# Altium schematic sheet MCU152A_F28E12X_Device.SchDoc
size 431 x 279 mm; Date: Not shown in title block; ApprovedBy: Not shown in title block; CheckedBy: Not shown in title block; Author: Not shown in title block; CompanyName: Not shown in title block; Engineer: Not shown in title block; Organization: Not shown in title block; Address1: Not shown in title block; Address2: Not shown in title block; Address3: Not shown in title block; Address4: Not shown in title block; DocumentNumber: 4; Revision: Use project parameter SCH_Rev; SheetNumber: 4; SheetTotal: 8; PageSetup: Record=PageOptions|CenterHorizontal=True|CenterVertical=True|PrintScale=1.00|XCorrection=1.00|YCorrection=1.00|PrintKind=0|BorderSize=5000000|LeftOffset=0|BottomOffset=0|Orientation=2|PaperLength=1000|PaperWidth=1000|Scale=100|PaperSource=15|PrintQuality=600|MediaType=1|DitherType=10|PaperKind=Letter|PrintScaleMode=1; Orderable: LAUNCHXL-F2800157; CurrentTime: Not shown in title block; CurrentDate: Not shown in title block; Time: Not shown in title block; DocumentFullPathAndName: Not shown in title block; DocumentName: Not shown in title block; ModifiedDate: Not shown in title block; ImagePath: Not shown in title block
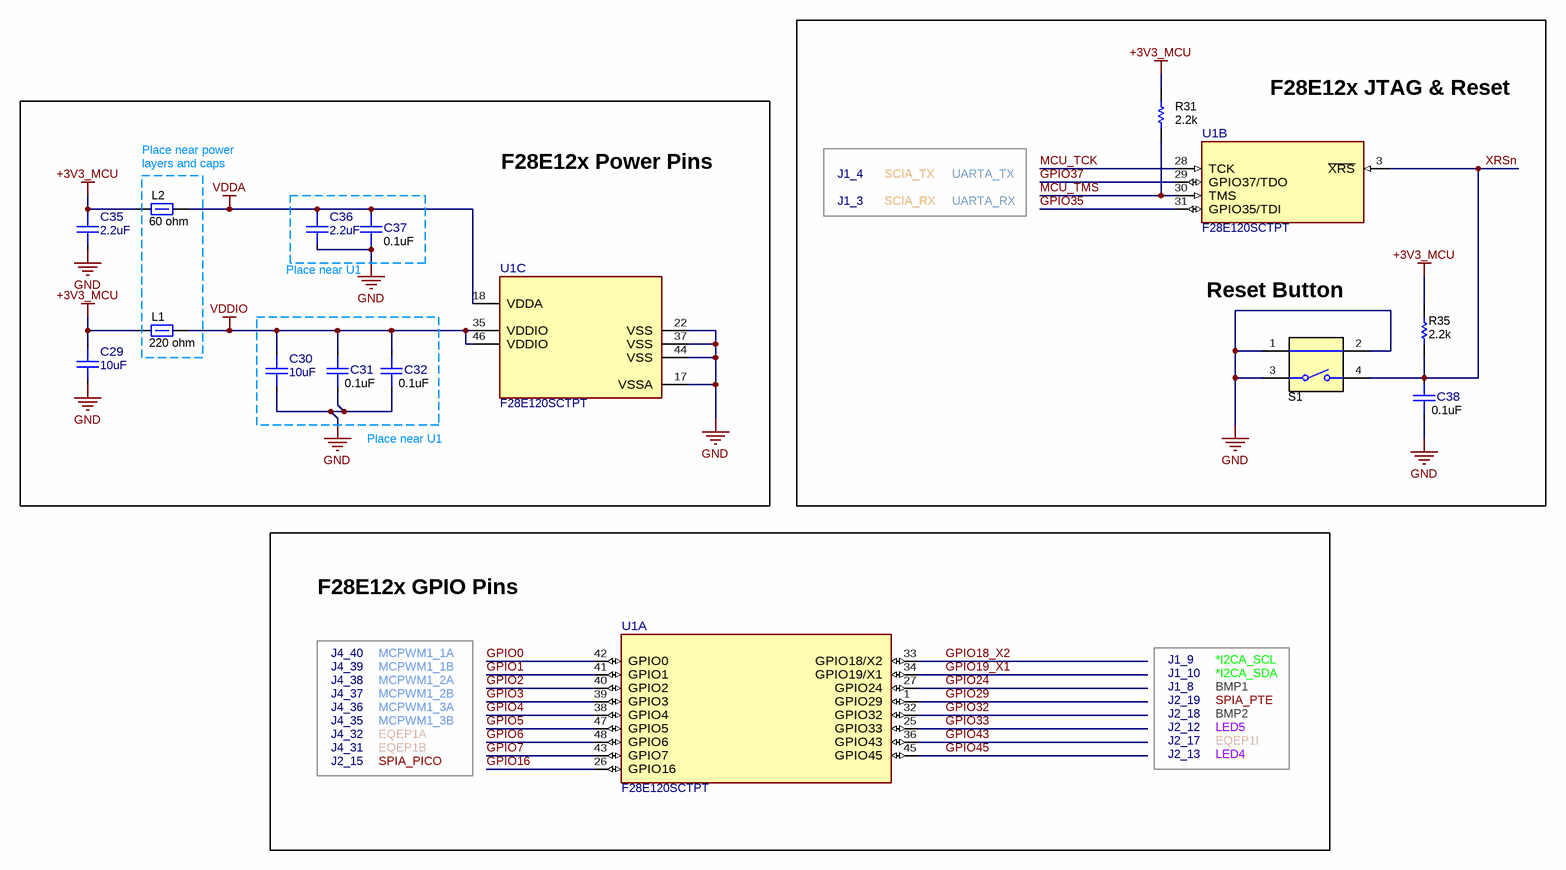
[diagram p0: MCU152A_F28E12X_Device.SchDoc]

## Parts
C29  ValueDisplayed: 10uF  [FP-885012106031_0603-MFG]  (hidden comment: 885012106031)
C30  ValueDisplayed: 10uF  [FP-885012106031_0603-MFG]  (hidden comment: 885012106031)
C31  ValueDisplayed: 0.1uF  [FP-885012205018_0402-MFG]  (hidden comment: 885012205018)
C32  ValueDisplayed: 0.1uF  [FP-885012205018_0402-MFG]  (hidden comment: 885012205018)
C35  ValueDisplayed: 2.2uF  [FP-885012106011_0603-MFG]  (hidden comment: 885012106011)
C36  ValueDisplayed: 2.2uF  [FP-885012106011_0603-MFG]  (hidden comment: 885012106011)
C37  ValueDisplayed: 0.1uF  [FP-885012205018_0402-MFG]  (hidden comment: 885012205018)
C38  ValueDisplayed: 0.1uF  [FP-885012205018_0402-MFG]  (hidden comment: 885012205018)
L1  ValueDisplayed: 220 ohm  [0805_HV]  (hidden comment: 742792022)
L2  value 60 ohm  [0805_HV]  (hidden comment: 742792063)
R31  ValueDisplayed: 2.2k  [0402]  (hidden comment: CRCW04022K20JNED)
R35  ValueDisplayed: 2.2k  [0402]  (hidden comment: CRCW04022K20JNED)
S1  1188E-1K2-V-TR  [SW_1188E]  (value not drawn)
U1  F28E120SCTPT  [PT0048A-MFG]  (parts A,B,C of 4)

## Blocks framed on the sheet
F28E12x Power Pins: C29-C32 C35-C37 L1 L2 U1
F28E12x GPIO Pins: U1

## Nets
+3V3_MCU: C29.1 C35.1 L1.1 L2.1 R31.2 R35.2
GND: C29.2 C30.2 C31.1 C32.1 C35.2 C36.2 C37.1 C38.1 S1.1 S1.2 S1.3 U1.17(VSSA) U1.22(VSS) U1.37(VSS) U1.44(VSS)
VDDA: C36.1 C37.2 L2.2 U1.18(VDDA)
VDDIO: C30.1 C31.2 C32.2 L1.2 U1.35(VDDIO) U1.46(VDDIO)
GPIO0: U1.42(GPIO0)
GPIO1: U1.41(GPIO1)
GPIO2: U1.40(GPIO2)
GPIO3: U1.39(GPIO3)
GPIO4: U1.38(GPIO4)
GPIO5: U1.47(GPIO5)
GPIO6: U1.48(GPIO6)
GPIO7: U1.43(GPIO7)
GPIO16: U1.26(GPIO16)
GPIO18_X2: U1.33(GPIO18/X2)
GPIO19_X1: U1.34(GPIO19/X1)
GPIO24: U1.27(GPIO24)
GPIO29: U1.1(GPIO29)
GPIO32: U1.32(GPIO32)
GPIO33: U1.25(GPIO33)
GPIO35: U1.31(GPIO35/TDI)
GPIO37: U1.29(GPIO37/TDO)
GPIO43: U1.36(GPIO43)
GPIO45: U1.45(GPIO45)
MCU_TCK: U1.28(TCK)
MCU_TMS: R31.1 U1.30(TMS)
XRSn: C38.2 R35.1 S1.4 U1.3(~{XRS})

## Notes on the sheet
- F28E12x JTAG & Reset
- (near L2) layers and caps
- Place near power
- J1_4
- J1_3
- SCIA_RX
- SCIA_TX
- UARTA_TX
- UARTA_RX
- Place near U1
- Reset Button
- J4_40
- J4_39
- J4_38
- J4_37
- MCPWM1_1A
- MCPWM1_1B
- MCPWM1_2A
- MCPWM1_2B
- J1_9
- J1_10
- J1_8
- J2_19
- *I2CA_SCL
- *I2CA_SDA
- SPIA_PTE
- BMP1
- J4_36
- J4_35
- J4_32
- J4_31
- J2_15
- SPIA_PICO
- EQEP1A
- EQEP1B
- MCPWM1_3A
- MCPWM1_3B
- J2_18
- J2_12
- J2_17
- J2_13
- BMP2
- LED5
- EQEP1I
- LED4
- Drawn By:
- SVN Rev:
- Number:
- TID #:
- Orderable:
- Rev:
- Sheet Title:
- File:
- Project Title:
- Designed for:
- Assembly Variant:
- Mod. Date:
- Sheet:
- Size:
- of
- B
- http://www.ti.com
- Texas Instruments and/or its licensors do not warrant the accuracy or completeness of this specification or any information contained therein. Texas Instruments and/or its licensors do not warrant that this design will meet the specifications, will be suitable for your application or fit for any particular purpose, or will operate in an implementation. Texas Instruments and/or its licensors do not warrant that the design is production worthy. You should completely validate and test your design implementation to confirm the system functionality for your application.
- Engineer:
- Contact:
- © Texas Instruments

## Library data of the parts
C29 C30 = CMP-0124926-1: 10 µF ±20% 25V Ceramic Capacitor X5R 0603 (1608 Metric); Manufacturer: Wurth; AEC Qualified: No; Cap_F: 10µF; SizeZ_mm: 1mm; TempCo: 15%; Value: 10µF; PackageReference: 0603; PartNumber: 885012106031; RoHS: TRUE; Tolerance_%: 20%; VDC_V: 25V; Part Number: 885012106031; datasheet: https://www.we-online.com/katalog/datasheet/885012106031.pdf; Datasheet Path: datasheets/Cap-885012106031.pdf; helpURL: https://upverter.com/upn/revision/3eb71e8268f7dbaa/; Lead Free: Yes; Operating Temperature Range: -55°C to +85°C; Temperature Characteristic: X5R; ComponentLink1Description: Datasheet; ComponentLink1URL: https://www.we-online.com/katalog/datasheet/885012106031.pdf
C31 C32 C37 C38 = CMP-0090362-1: 0.1µF ±10% 10V Ceramic Capacitor X7R 0402 (1005 Metric); Manufacturer: Wurth Electronics; AEC Qualified: No; Value: 100nF; SizeZ_mm: 0.55mm; TempCo: 15%; RoHS: TRUE; Tolerance_%: 10%; datasheet: https://www.we-online.com/catalog/datasheet/885012205018.pdf; Lead Free: Yes; Operating Temperature Range: -55°C to +125°C; ComponentLink1Description: Datasheet; Digikey Description: CAP CER 0.1UF 10V X7R 0402; Supplier Part Number 1: 732-7513-1-ND; Supplier 2: Mouser; Mouser Part Number: 710-885012205018; Digikey Part Number: 732-7513-1-ND; Temperature Characteristic: X7R; Supplier 1: Digikey; Datasheet Path: datasheets/Cap-885012205018.pdf; ComponentLink1URL: https://www.we-online.com/catalog/datasheet/885012205018.pdf; VDC_V: 10V; Supplier Part Number 2: 710-885012205018; Cap_F: 100nF; PackageReference: 0402; PartNumber: 885012205018; Part Number: 885012205018; helpURL: https://upverter.com/upn/revision/1acbe355db19639d/
C35 C36 = CMP-0124925-1: 2.2 µF ±20% 10V Ceramic Capacitor X5R 0603 (1608 Metric); Manufacturer: Wurth Electronics; AEC Qualified: No; Cap_F: 2.2µF; SizeZ_mm: 0.87mm; TempCo: 15%; Value: 2.2µF; PackageReference: 0603; PartNumber: 885012106011; RoHS: TRUE; Supplier 1: Digikey; Supplier 2: Mouser; Supplier Part Number 1: 732-7908-1-ND; Supplier Part Number 2: 710-885012106011; Tolerance_%: 20%; VDC_V: 10V; Part Number: 885012106011; datasheet: https://www.we-online.com/components/products/datasheet/885012106011.pdf; Datasheet Date: 2021-01-03; Datasheet Path: datasheets/Cap-885012106011.pdf; Datasheet Version: 002.000; Digikey Description: CAP CER 2.2UF 10V X5R 0603; Digikey Part Number: 732-7908-1-ND; helpURL: https://upverter.com/upn/revision/043a68a068ea15af/; Lead Free: Yes; Mouser Part Number: 710-885012106011; Operating Temperature Range: -55°C to +85°C; Temperature Characteristic: X5R; ComponentLink1Description: Datasheet; ComponentLink1URL: https://www.we-online.com/components/products/datasheet/885012106011.pdf
L1 = CMP-0003073-1: Ferrite Bead, 220 ohm @ 100 MHz, 2 A, 0805; Manufacturer: Wurth Elektronik; Ztyp@1GHz_Ohm: 190.289; ZTyp@100MHz_Ohm: 220; SizeAreaWB_mm2: 6.75; DCR_ohm: 0.05; Value1: 0.05 ohm; Value: 220 ohm; Imax_A: 2A; SizeZ_mm: 1.45; SizeX_mm: 2; SizeY_mm: 1.25; SizeArea_mm2: 2.5; ComponentLink1URL: http://katalog.we-online.de/pbs/datasheet/742792022.pdf; Supplier Part Number 2: 710-742792022; Publisher: Texas Instruments; Supplier 2: Mouser; Published: 2014-04-30; RoHS: Y; MountType: SMT; Supplier 1: Digi-Key; PackageReference: 0805; Value2: 2A; CompType: Ferrite Bead; LatestRevisionDate: 2017-03-09; PartNumber: 742792022; ComponentLink1Description: Datasheet link; Supplier Part Number 1: 732-1614-1-ND
L2 = CMP-0003093-1: Ferrite Bead, 60 ohm @ 100 MHz, 3 A, 0805; Manufacturer: Wurth Elektronik; Ztyp@1GHz_Ohm: 95.384; ZTyp@100MHz_Ohm: 60; SizeAreaWB_mm2: 6.75; DCR_ohm: 0.025; Value1: 0.025 ohm; Imax_A: 3A; SizeZ_mm: 1.45; SizeX_mm: 2; SizeY_mm: 1.25; SizeArea_mm2: 2.5; ComponentLink1URL: http://katalog.we-online.de/pbs/datasheet/742792063.pdf; Supplier Part Number 2: 710-742792063; Publisher: Texas Instruments; Supplier 2: Mouser; Published: 2014-04-30; RoHS: Y; MountType: SMT; Supplier 1: Digi-Key; PackageReference: 0805; Value2: 3A; CompType: Ferrite Bead; LatestRevisionDate: 2017-03-09; PartNumber: 742792063; ComponentLink1Description: Datasheet link; Supplier Part Number 1: 732-1612-1-ND; ValueDisplayed: 60 ohm
R31 R35 = CMP-0026890-5: RES, 2.2 k, 5%, 0.063 W, AEC-Q200 Grade 0, 0402; Manufacturer: Vishay-Dale; Value: 2.2k; Value_Code: 2k20; Power_W: 63mW; Value2: 0.063W; VDC_V: 50V; TempCo: 200 ppm/C; EIA_Code: E24; AEC Category: Q200; AEC Qualified: Y; AEC Grade: 0; SizeArea_mm2: 0.5; SizeX_mm: 1; SizeZ_mm: 0.6; CompType: Resistor; PartNumber: CRCW04022K20JNED; PackageReference: 0402; RoHS: E; Res_ohm: 2.2k; Tolerance_%: 5%; Value1: 5%; MountType: SMT; Technology: Thick Film; ComponentLink1Description: Datasheet link; ComponentLink1URL: http://www.vishay.com/docs/20035/dcrcwe3.pdf; Supplier 1: Digi-Key; Supplier Part Number 1: 541-2.2KJCT-ND; Supplier 2: Newark; Supplier Part Number 2: 59M6710; Supplier 3: Mouser; Supplier Part Number 3: 71-CRCW0402J-2.2K-E3; SizeY_mm: 0.5
S1 = CMP-0002328-1: Switch, SPST, 0.05 A, 12 VDC, SMD; Manufacturer: Diptronics; SizeAreaWB_mm2: 53.9; SizeArea_mm2: 27.3; SizeX_mm: 7.8; SizeY_mm: 3.5; VDC_V: 12V; PositionCount: 1; CurrentRating_mA: 50A; PartNumber: 1188E-1K2-V-TR; MountType: SMT; SizeZ_mm: 3.5; ComponentLink1Description: Datasheet URL; ComponentLink1URL: http://www.dip.com.tw/en/en-product-information/en-switch004/item/download/1976_b080c057386714e3a6604cbe658b9df3; RoHS: Y; Circuit: SPST; Orientation: Side Actuated; CompType: Switch; PackageReference: 7.8x3.5mm; Publisher: Texas Instruments; LatestRevisionDate: 2017-03-09
U1 = CMP-0125361-1: F28E12x Real-Time Microcontrollers; Manufacturer: Texas Instruments; SizeZ_mm: 1.6mm; Core Architecture: C28x; Data Bus Width: 32bits; Frequency_Fixed: 160MHz; Interface: I2C,SPI,UART,SCI; Max Supply Voltage: 3.63V; Memory Size: 128KBytes; Memory Type: FLASH; Min Supply Voltage: 2.8V; Number Of A/D Converters: 1; Number Of Adc Channels: 9; Number Of I/Os: 27; Number Of Pwm Channels: 8; Number Of Timers/Counters: 4; Number Of Uart Channels: 2; Ram Size: 16KBytes; Standoff Height: 0.05mm; TJmax_C: +125°C; PackageReference: LQFP48; PartNumber: F28E120SCTPT; RoHS: UNKNOWN; Operating Temperature Range: -40°C to +125°C; Part Number: F28E120SCTPT; Datasheet Path: datasheets/IC-F28E120SCTPT.pdf; helpURL: https://upverter.com/upn/revision/b1ad6dff89e73838/; Number Of Cores: 1; Number Of I2C Channels: 1; Number Of Spi Channels: 1; PartId: 1